# Altium schematic sheet UserPanel.SchDoc
size A4; SheetNumber: 11; SheetTotal: 12
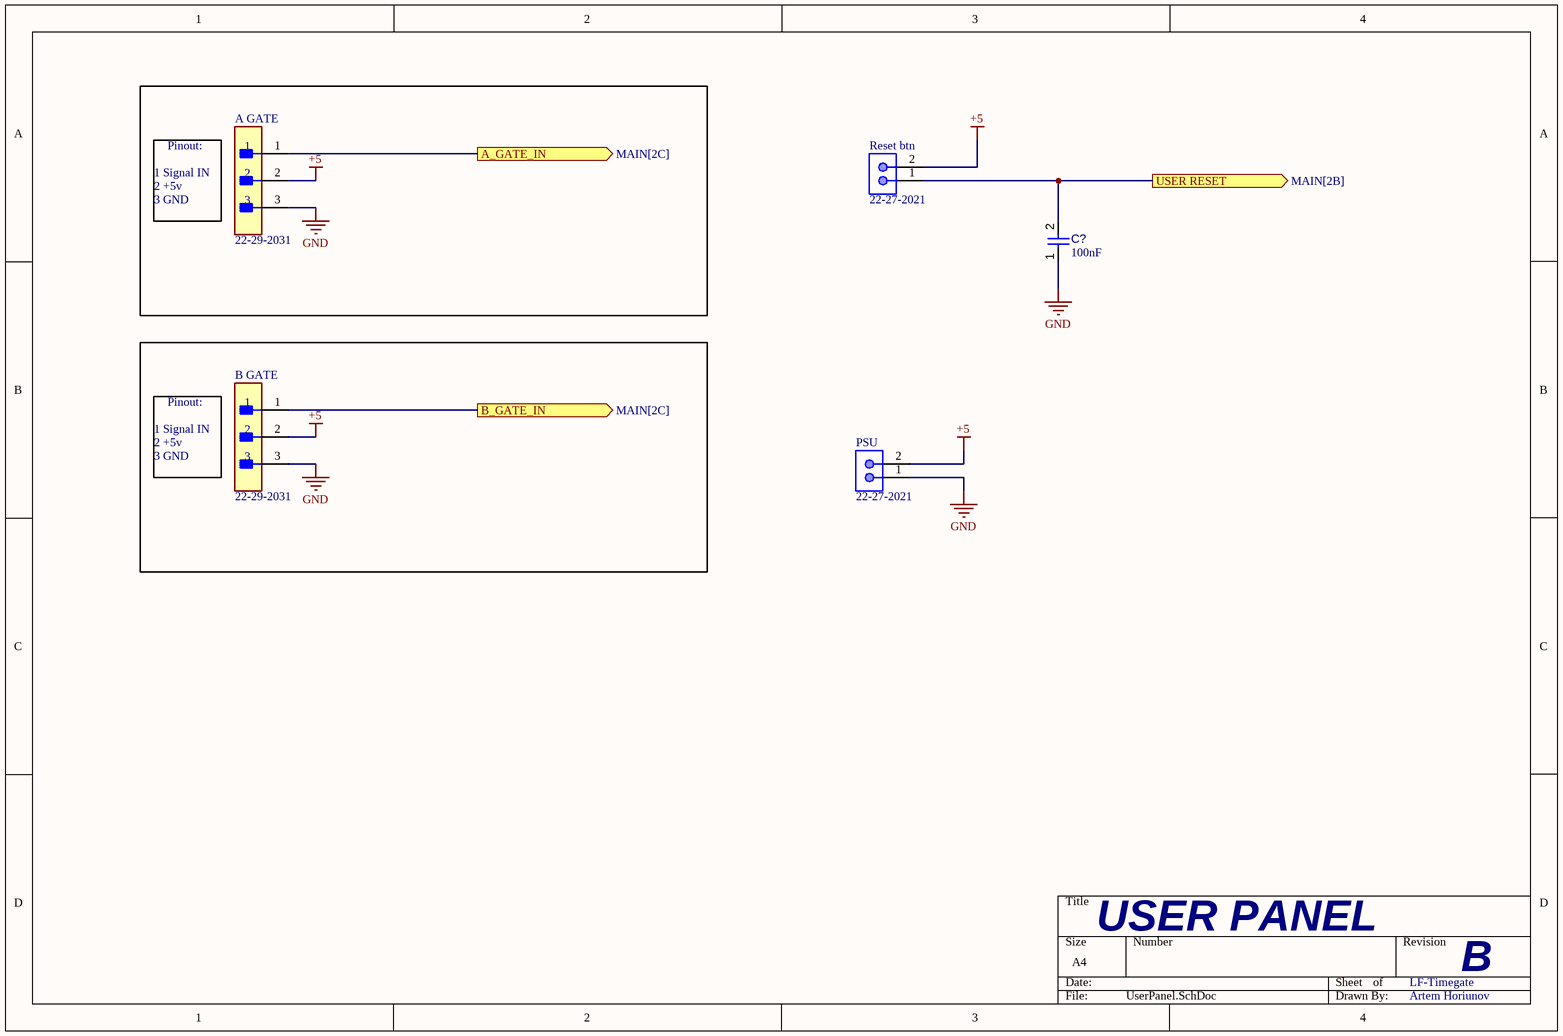
[diagram p0: UserPanel.SchDoc]

## Parts
A_GATE  22-29-2031  [FP-22-29-2031-MFG]
B_GATE  22-29-2031  [FP-22-29-2031-MFG]
C?  value 100nF  [CAPC2013X95X50LL10T25]  (hidden comment: Capacitor 100 nF +/-10% 50 V 0805)
PSU  22-27-2021  [MOLX-22-27-2021_V]
Reset_btn  22-27-2021  [MOLX-22-27-2021_V]

## Ports
A_GATE_IN (out, see MAIN[2C]), B_GATE_IN (out, see MAIN[2C]), USER RESET (out, see MAIN[2B])

## Nets
+5: A_GATE.2 B_GATE.2 PSU.2 Reset_btn.2
GND: A_GATE.3 B_GATE.3 C?.1 PSU.1
A_GATE_IN: A_GATE.1 ; port A_GATE_IN
B_GATE_IN: B_GATE.1 ; port B_GATE_IN
USER RESET: C?.2 Reset_btn.1 ; port USER RESET

## Notes on the sheet
- (near A_GATE) 1 Signal IN
- (near A_GATE) Pinout:
- 2 +5v
- 3 GND
- (near B_GATE) 1 Signal IN
- (near B_GATE) Pinout:
- USER PANEL
- LF-Timegate
- B
- Artem Horiunov

## Library data of the parts
A_GATE B_GATE = CMP-04776-000327-1: CONN HEADER VERT 3POS 2.54MM; Contact Resistance: 10mR; Number of Positions: 3; Voltage Rating: 250V; Gender: Male; Connector Type: Male Pin; Current Rating: 4A; Packaging: Bulk; Housing Material: Nylon; Min Operating Temperature: 0°C; Color: Natural; RoHS Compliant: Yes; Housing Color: White; Number of Rows: 1; Pitch: 2.54mm; Mount: Through Hole; Fastening Type: Friction; Length: 7.62mm; Depth: 5.8mm; Contact Material: Brass; Max Operating Temperature: 75°C; Number of Contacts: 3; Contact Type: Male Pin; Working Voltage: 250V; Orientation: Straight; Lead Pitch: 2.54mm; Radiation Hardening: No; Termination: Solder; Contact Plating: Gold; Contact Mating Length: 0.295inch; Series: KK® 6410
C? = CMP-001-00018-6: Chip Capacitor, 100 nF, +/- 10%, 50 V, 0805 (2012 Metric); Capacitor Type: Ceramic; Voltage Rating: 50V; Pins: 2; Max Operating Temperature: 125°C; Min Operating Temperature: -55°C; Mounting Technology: SM; Case/Package: 0805; RoHS Compliant: True; Tolerance: 10%
PSU Reset_btn = CMP-2000-05537-1: Male Header, Pitch 2.54 mm, 1 x 2 Position, Height 11.7 mm, Tail Length 3.56 mm, 0 to 75 degC, RoHS, Bulk; Manufacturer: Molex; PartNumber: 0022272021; Current rating: 4A; Package Version: Rev. BC, 02/2012; Voltage rating: 250V; No. of Positions: 2; Pitch: 2.54mm; No. of Rows: 1; Orientation: Vertical; Operating temperature: 0°Cto+75°C; Manufacturer URL: http://www.molex.com/; Mounting Technology: ThroughHole; Housing material: Nylon(UL94V-0); Package Description: 2-Leads Header, Body 5.08 x 5.8 mm, Pitch 2.54 mm; Voltage - Max: 250V; Datasheet URL: http://www.molex.com/pdm_docs/sd/022272021_sd.pdf; Package Reference: 22-27-2021; Contact material: Tinplatedbrass; Current - Max: 4A; Datasheet Version: Rev. F, 06/2009